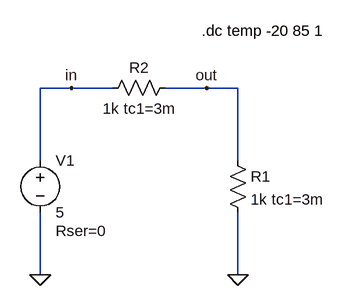
[diagram p0: schematic priklad2.asc]
priklad2.asc, the LTspice schematic file:
Version 4
SHEET 1 880 680
WIRE -288 -48 -336 -48
WIRE -224 -48 -288 -48
WIRE -80 -48 -144 -48
WIRE -32 -48 -80 -48
WIRE -336 64 -336 -48
WIRE -32 64 -32 -48
WIRE -336 240 -336 144
WIRE -32 240 -32 144
FLAG -32 240 0
FLAG -336 240 0
FLAG -288 -48 in
FLAG -80 -48 out
SYMBOL res -48 48 R0
SYMATTR InstName R1
SYMATTR Value 1k tc1=3m
SYMBOL res -128 -64 R90
WINDOW 0 0 56 VBottom 2
WINDOW 3 32 56 VTop 2
SYMATTR InstName R2
SYMATTR Value 1k tc1=3m
SYMBOL voltage -336 48 R0
WINDOW 123 0 0 Left 2
WINDOW 39 24 124 Left 2
SYMATTR InstName V1
SYMATTR Value 5
SYMATTR SpiceLine Rser=0
TEXT -88 -136 Left 2 !.dc temp -20 85 1

The netlist it stands for:
* priklad2.asc
R1 out 0 1k tc1=3m
R2 out in 1k tc1=3m
V1 in 0 5 Rser=0
.dc temp -20 85 1
.backanno
.end